# EAGLE design RPiPWM (EAGLE 9.0.1)
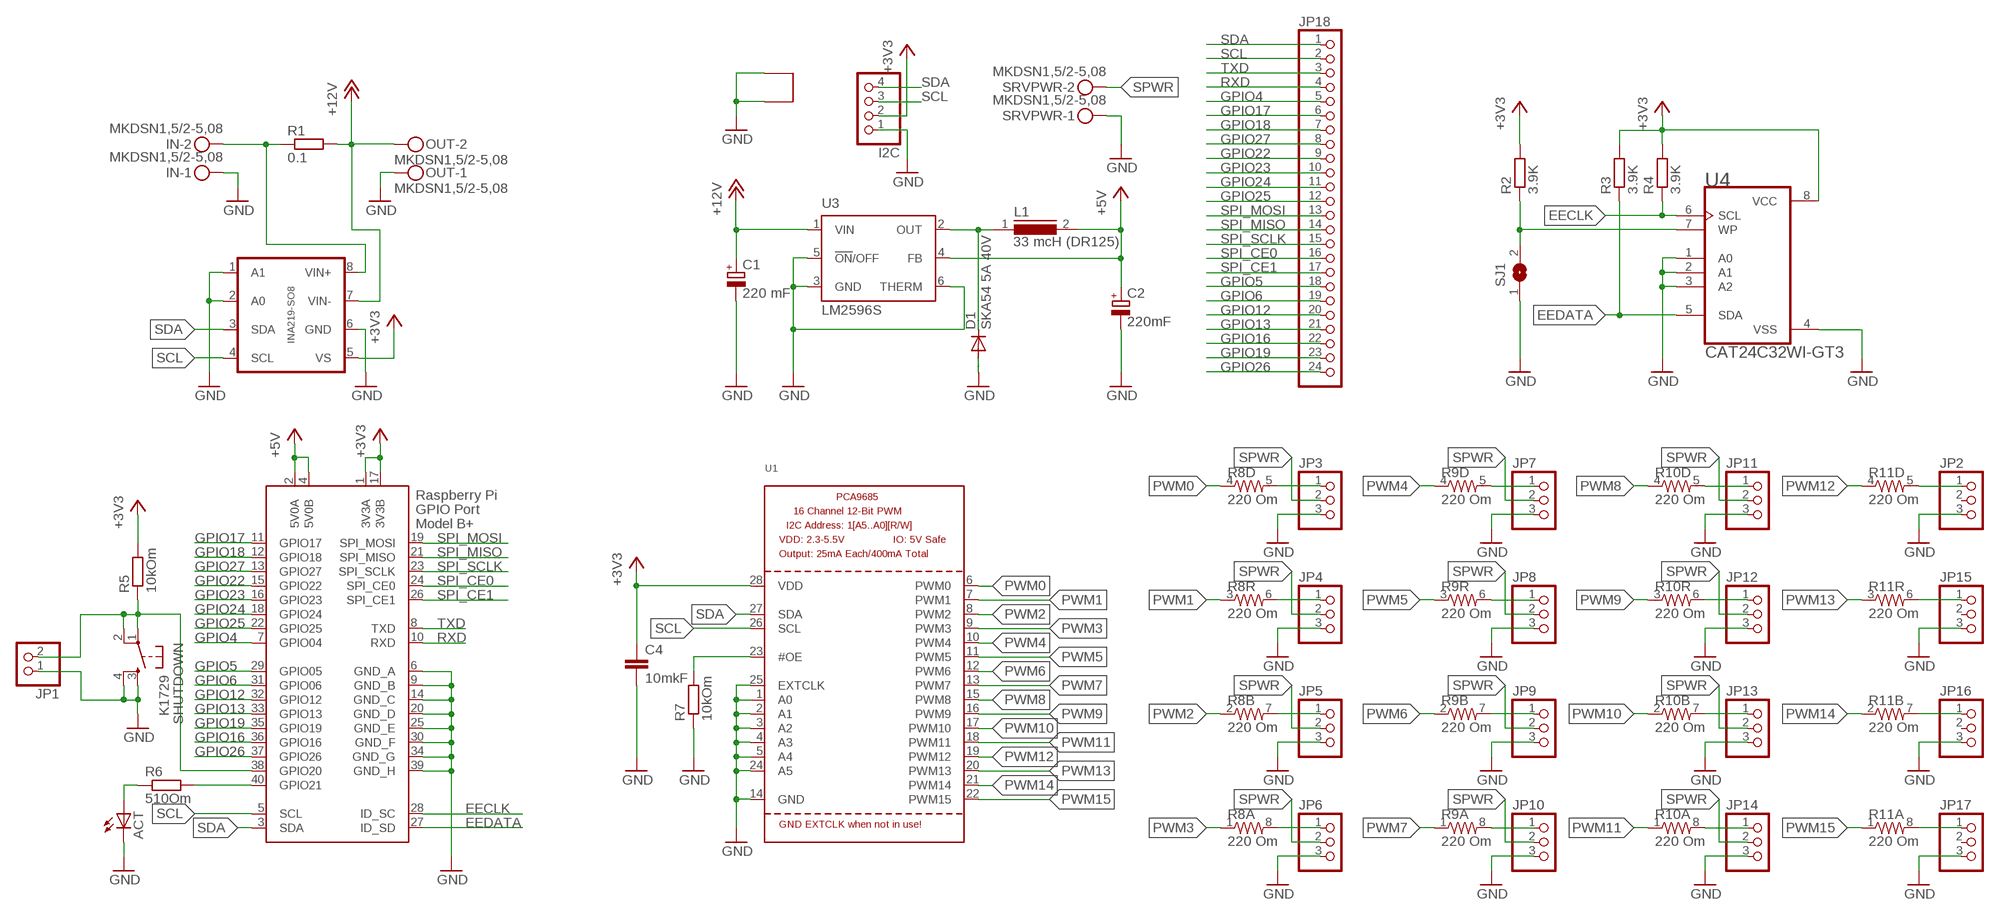
[diagram p0: schematic, sheet 1]

## Parts
ACT  LEDCHIPLED_1206  [CHIPLED_1206]
C1  220 mF  CPOL-EU140CLH-1014  [140CLH-1014]
C2  220mF  CPOL-EU140CLH-1014  [140CLH-1014]
C4  10mkF  C-EUC0805K  [C0805K]
D1  SKA54 5A 40V  DIODE-SMB  [SMB]
GNDLOOP  LOOP  [LOOP]
I2C  PINHD-1X04_2.54-S  [1X04-S]
IN  MKDSN1,5/2-5,08  [MKDSN1,5/2-5,08]
JP1  PINHD-1X02_2.54-S  [1X02-S]
JP2  PINHD-1X03_2.54-S  [1X03-S]
JP3  PINHD-1X03_2.54-S  [1X03-S]
JP4  PINHD-1X03_2.54-S  [1X03-S]
JP5  PINHD-1X03_2.54-S  [1X03-S]
JP6  PINHD-1X03_2.54-S  [1X03-S]
JP7  PINHD-1X03_2.54-S  [1X03-S]
JP8  PINHD-1X03_2.54-S  [1X03-S]
JP9  PINHD-1X03_2.54-S  [1X03-S]
JP10  PINHD-1X03_2.54-S  [1X03-S]
JP11  PINHD-1X03_2.54-S  [1X03-S]
JP12  PINHD-1X03_2.54-S  [1X03-S]
JP13  PINHD-1X03_2.54-S  [1X03-S]
JP14  PINHD-1X03_2.54-S  [1X03-S]
JP15  PINHD-1X03_2.54-S  [1X03-S]
JP16  PINHD-1X03_2.54-S  [1X03-S]
JP17  PINHD-1X03_2.54-S  [1X03-S]
JP18  PINHD-1X24_2.54-S  [1X24-S]
L1  33 mcH (DR125)  DR125  [DR125]
OUT  MKDSN1,5/2-5,08  [MKDSN1,5/2-5,08]
R1  0.1  R-EU_R2512  [R2512]
R2  3.9K  R-EU_R0805  [R0805]
R3  3.9K  R-EU_R0805  [R0805]
R4  3.9K  R-EU_R0805  [R0805]
R5  10kOm  R-EU_R0805  [R0805]
R6  510Om  R-EU_R0805  [R0805]
R7  10kOm  R-EU_R0805  [R0805]
R8  220 Om  RESISTOR-ARRAY0603-ARV  [0603-ARV]
R9  220 Om  RESISTOR-ARRAY0603-ARV  [0603-ARV]
R10  220 Om  RESISTOR-ARRAY0603-ARV  [0603-ARV]
R11  220 Om  RESISTOR-ARRAY0603-ARV  [0603-ARV]
SHUTDOWN  K1729  [DTSM-6]
SJ1  SJ  [SJ]
SRVPWR  MKDSN1,5/2-5,08  [MKDSN1,5/2-5,08]
U1  PCA9685  [TSSOP28]
U2  INA219-SO8D  [SO08]
U3  LM2596S  [TO263-5]
U4  CAT24C32WI-GT3  [SOIC127P600X175-8N]
X1  RASPI_BOARD_B+#_HDC  [RASPI_BOARD_B+HAT_DF_CF]

## Nets
+3V3: C4.1 I2C.2 R2.2 R3.2 R4.2 R5.2 U1.28(VDD) U2.5(VS) U4.8(VCC) X1.1(3V3A) X1.17(3V3B)
+5V: C2.+ L1.2 U3.4(FB) X1.2(5V0A) X1.4(5V0B)
+12V: C1.+ OUT.2 R1.2 U2.7(VIN-) U3.1(VIN)
EECLK: R4.1 U4.6(SCL) X1.28(ID_SC)
EEDATA: R3.1 U4.5(SDA) X1.27(ID_SD)
GND: ACT.C C1.- C2.- C4.2 D1.A GNDLOOP.P$1 GNDLOOP.P$2 I2C.1 IN.1 JP1.1 JP2.3 JP3.3 JP4.3 JP5.3 JP6.3 JP7.3 JP8.3 JP9.3 JP10.3 JP11.3 JP12.3 JP13.3 JP14.3 JP15.3 JP16.3 JP17.3 OUT.1 R7.1 SHUTDOWN.3 SHUTDOWN.4 SJ1.1 SRVPWR.1 U1.1(A0) U1.2(A1) U1.3(A2) U1.4(A3) U1.5(A4) U1.14(GND) U1.24(A5) U1.25(EXTCLK) U2.1(A1) U2.2(A0) U2.6(GND) U3.3(GND) U3.5(!ON!/OFF) U3.6(THERM) U4.1(A0) U4.2(A1) U4.3(A2) U4.4(VSS) X1.6(GND_A) X1.9(GND_B) X1.14(GND_C) X1.20(GND_D) X1.25(GND_E) X1.30(GND_F) X1.34(GND_G) X1.39(GND_H)
GPIO4: JP18.5 X1.7(GPIO04)
GPIO5: JP18.18 X1.29(GPIO05)
GPIO6: JP18.19 X1.31(GPIO06)
GPIO12: JP18.20 X1.32(GPIO12)
GPIO13: JP18.21 X1.33(GPIO13)
GPIO16: JP18.22 X1.36(GPIO16)
GPIO17: JP18.6 X1.11(GPIO17)
GPIO18: JP18.7 X1.12(GPIO18)
GPIO19: JP18.23 X1.35(GPIO19)
GPIO22: JP18.9 X1.15(GPIO22)
GPIO23: JP18.10 X1.16(GPIO23)
GPIO24: JP18.11 X1.18(GPIO24)
GPIO25: JP18.12 X1.22(GPIO25)
GPIO26: JP18.24 X1.37(GPIO26)
GPIO27: JP18.8 X1.13(GPIO27)
N$1: R6.2 X1.40(GPIO21)
N$2: ACT.A R6.1
N$3: D1.C L1.1 U3.2(OUT)
N$4: JP1.2 R5.1 SHUTDOWN.1 SHUTDOWN.2 X1.38(GPIO20)
N$5: JP3.1 R8.5
N$6: JP4.1 R8.6
N$7: JP7.1 R9.5
N$8: JP5.1 R8.7
N$9: R2.1 SJ1.2 U4.7(WP)
N$10: JP6.1 R8.8
N$11: JP11.1 R10.5
N$12: JP2.1 R11.5
N$13: JP15.1 R11.6
N$14: JP16.1 R11.7
N$15: JP17.1 R11.8
N$16: JP14.1 R10.8
N$17: JP13.1 R10.7
N$18: JP12.1 R10.6
N$19: JP8.1 R9.6
N$20: JP9.1 R9.7
N$21: JP10.1 R9.8
N$22: IN.2 R1.1 U2.8(VIN+)
N$23: R7.2 U1.23(#OE)
PWM0: R8.4 U1.6(PWM0)
PWM1: R8.3 U1.7(PWM1)
PWM2: R8.2 U1.8(PWM2)
PWM3: R8.1 U1.9(PWM3)
PWM4: R9.4 U1.10(PWM4)
PWM5: R9.3 U1.11(PWM5)
PWM6: R9.2 U1.12(PWM6)
PWM7: R9.1 U1.13(PWM7)
PWM8: R10.4 U1.15(PWM8)
PWM9: R10.3 U1.16(PWM9)
PWM10: R10.2 U1.17(PWM10)
PWM11: R10.1 U1.18(PWM11)
PWM12: R11.4 U1.19(PWM12)
PWM13: R11.3 U1.20(PWM13)
PWM14: R11.2 U1.21(PWM14)
PWM15: R11.1 U1.22(PWM15)
RXD: JP18.4 X1.10(RXD)
SCL: I2C.3 JP18.2 U1.26(SCL) U2.4(SCL) X1.5(SCL)
SDA: I2C.4 JP18.1 U1.27(SDA) U2.3(SDA) X1.3(SDA)
SPI_CE0: JP18.16 X1.24(SPI_CE0)
SPI_CE1: JP18.17 X1.26(SPI_CE1)
SPI_MISO: JP18.14 X1.21(SPI_MISO)
SPI_MOSI: JP18.13 X1.19(SPI_MOSI)
SPI_SCLK: JP18.15 X1.23(SPI_SCLK)
SPWR: JP3.2 JP4.2 JP5.2 JP6.2 JP7.2 JP8.2 JP9.2 JP10.2 JP11.2 JP12.2 JP13.2 JP14.2 SRVPWR.2
TXD: JP18.3 X1.8(TXD)
Unconnected: JP2.2 JP15.2 JP16.2 JP17.2

## Library data of the parts
ACT = led:LED: LED OSRAM: - CHIPLED LG R971, LG N971, LY N971, LG Q971, LY Q971, LO R971, LY R971 LH N974, LH R974 LS Q976, LO Q976, LY Q976 LO Q996 - Hyper CHIPLED LW Q18S LB Q993, LB Q99A, LB R99A - SideLED LS A670, LO A670, LY A670, LG A670, LP A670 LB A673, LV A673, LT A673, LW A673 LH A674 LY A675 LS A676, LA A676, LO A676, LY A676, LW A676 LS A679, LY A679, LG A679 - Hyper Micro SIDELED® LS Y876, LA Y876, LO Y876, LY Y876 LT Y87S - SmartLED LW L88C, LW L88S LB L89C, LB L89S, LG L890 LS L89K, LO L89K, LY L89K LS L896, LA L896, LO L896, LY L896 - TOPLED LS T670, LO T670, LY T670, LG T670, LP T670 LSG T670, LSP T670, LSY T670, LOP T670, LYG T670 LG T671, LOG T671, LSG T671 LB T673, LV T673, LT T673, LW T673 LH T674 LS T676, LA T676, LO T676, LY T676, LB T676, LH T676, LSB T676, LW T676 LB T67C, LV T67C, LT T67C, LS T67K, LO T67K, LY T67K, LW E67C LS E67B, LA E67B, LO E67B, LY E67B, LB E67C, LV E67C, LT E67C LW T67C LS T679, LY T679, LG T679 LS T770, LO T770, LY T770, LG T770, LP T770 LB T773, LV T773, LT T773, LW T773 LH T774 LS E675, LA E675, LY E675, LS T675 LS T776, LA T776, LO T776, LY T776, LB T776 LHGB T686 LT T68C, LB T68C - Hyper Mini TOPLED® LB M676 - Mini TOPLED Santana® LG M470 LS M47K, LO M47K, LY M47K Source: http://www.osram.convergy.de LUXEON: - LUMILED® LXK2-PW12-R00, LXK2-PW12-S00, LXK2-PW14-U00, LXK2-PW14-V00 LXK2-PM12-R00, LXK2-PM12-S00, LXK2-PM14-U00 LXK2-PE12-Q00, LXK2-PE12-R00, LXK2-PE12-S00, LXK2-PE14-T00, LXK2-PE14-U00 LXK2-PB12-K00, LXK2-PB12-L00, LXK2-PB12-M00, LXK2-PB14-N00, LXK2-PB14-P00, LXK2-PB14-Q00 LXK2-PR12-L00, LXK2-PR12-M00, LXK2-PR14-Q00, LXK2-PR14-R00 LXK2-PD12-Q00, LXK2-PD12-R00, LXK2-PD12-S00 LXK2-PH12-R00, LXK2-PH12-S00 LXK2-PL12-P00, LXK2-PL12-Q00, LXK2-PL12-R00 Source: www.luxeon.com KINGBRIGHT: KA-3528ASYC Source: www.kingbright.com
C1 C2 = rcl:CPOL-EU: POLARIZED CAPACITOR, European symbol; SPICEPREFIX: C
C4 = rcl:C-EU: CAPACITOR, European symbol; SPICEPREFIX: C
D1 = diode:DIODE-: DIODE
GNDLOOP = newlib:LOOP
I2C = pinhead-2:PINHD-1X04: PIN HEADER
IN OUT SRVPWR = con-phoenix-508:MKDSN1,5/2-5,08: MKDSN 1,5/ 2-5,08 Printklemme Nennstrom: 13,5 A Nennspannung: 250 V Rastermaß: 5,08 mm Polzahl: 2 Anschlussart: Schraubanschluss Montage: Löten Anschlussrichtung Leiter/Platine: 0 ° Artikelnummer: 1729128 Source: http://eshop.phoenixcontact.com .. 1729128.pdf
JP1 = pinhead-2:PINHD-1X02: PIN HEADER
JP2-JP17 = pinhead-2:PINHD-1X03: PIN HEADER
JP18 = pinhead-2:PINHD-1X24: PIN HEADER
L1 = inductors:DR125: High Power Density, High Efficiency, Shielded Inductors Source: coiltronics_dr_series.pdf; SPICEPREFIX: L
R1-R7 = rcl:R-EU_: RESISTOR, European symbol; SPICEPREFIX: R
R8-R11 = SparkFun-Resistors:RESISTOR-ARRAY: Array Chip Resistor Source: RS Component / Phycomp
SHUTDOWN = switch-tact:K1729
SJ1 = jumper:SJ: SMD solder JUMPER
U1 = adafruit:PCA9685: PCA9685 - 16 Channel 12-Bit I2C PWM Controller 5.0V tolerant 16 channel, 12-bit I2C PWM controller with 25mA per output (max. 400mA total) Digikey: 568-5931-1-ND
U2 = INA219 :INA219-SO8: INA219 Bi-Directional CURRENT/POWER MONITOR with I2C™ Interface http://www.ti.com/lit/ds/symlink/ina219.pdf
U3 = newlib:LM2596S
U4 = CAT24C32WI-GT3:CAT24C32WI-GT3: CAT24C32 Series 32 Kb (4K X 8) 1.8 V - 5.5 V I2C CMOS Serial EEPROM - SOIC-8; AVAILABILITY: Unavailable; DESCRIPTION: IC EEPROM 32KBIT 400KHZ 8SOIC; MF: ON; MP: CAT24C32WI-GT3; PACKAGE: SOIC-8 ON; PRICE: None
X1 = raspberrypi_bastelstube_v13:RASPI_BOARD_B+#: Raspberry Pi GPIO connector with markings for the outer dimensions of the Raspberry Pi board model B+ with different sets of drill holes or mounting pads All pins connected

## Board
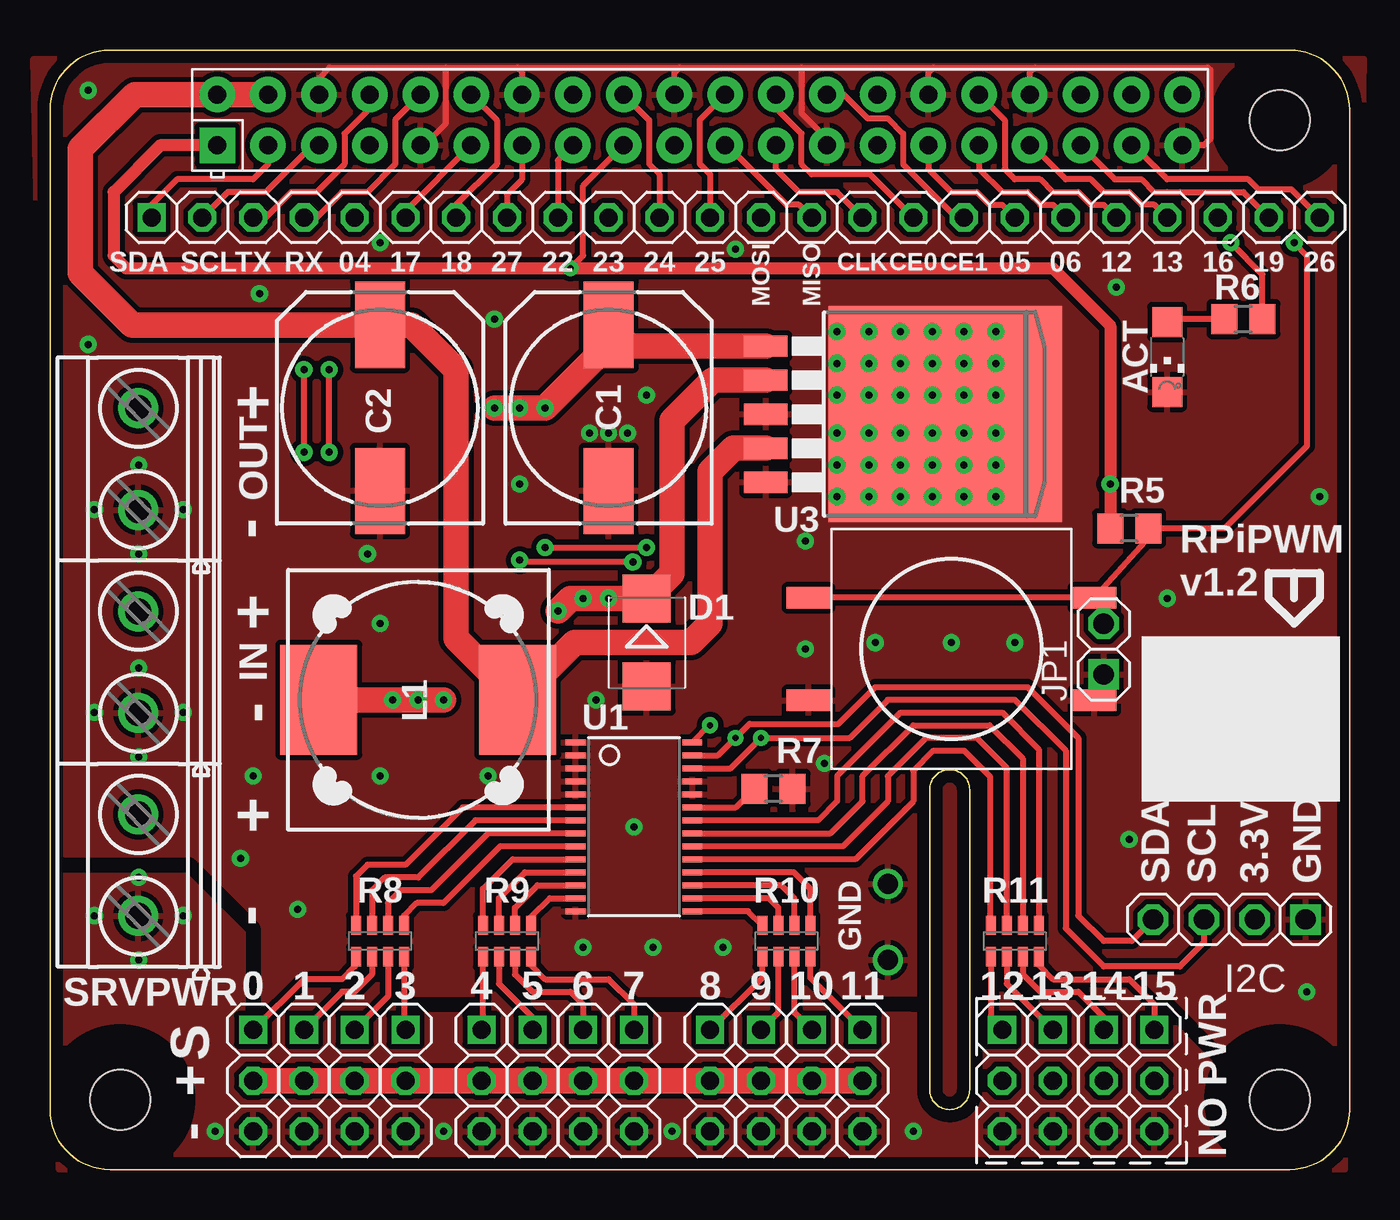
[diagram p1: board, top side]
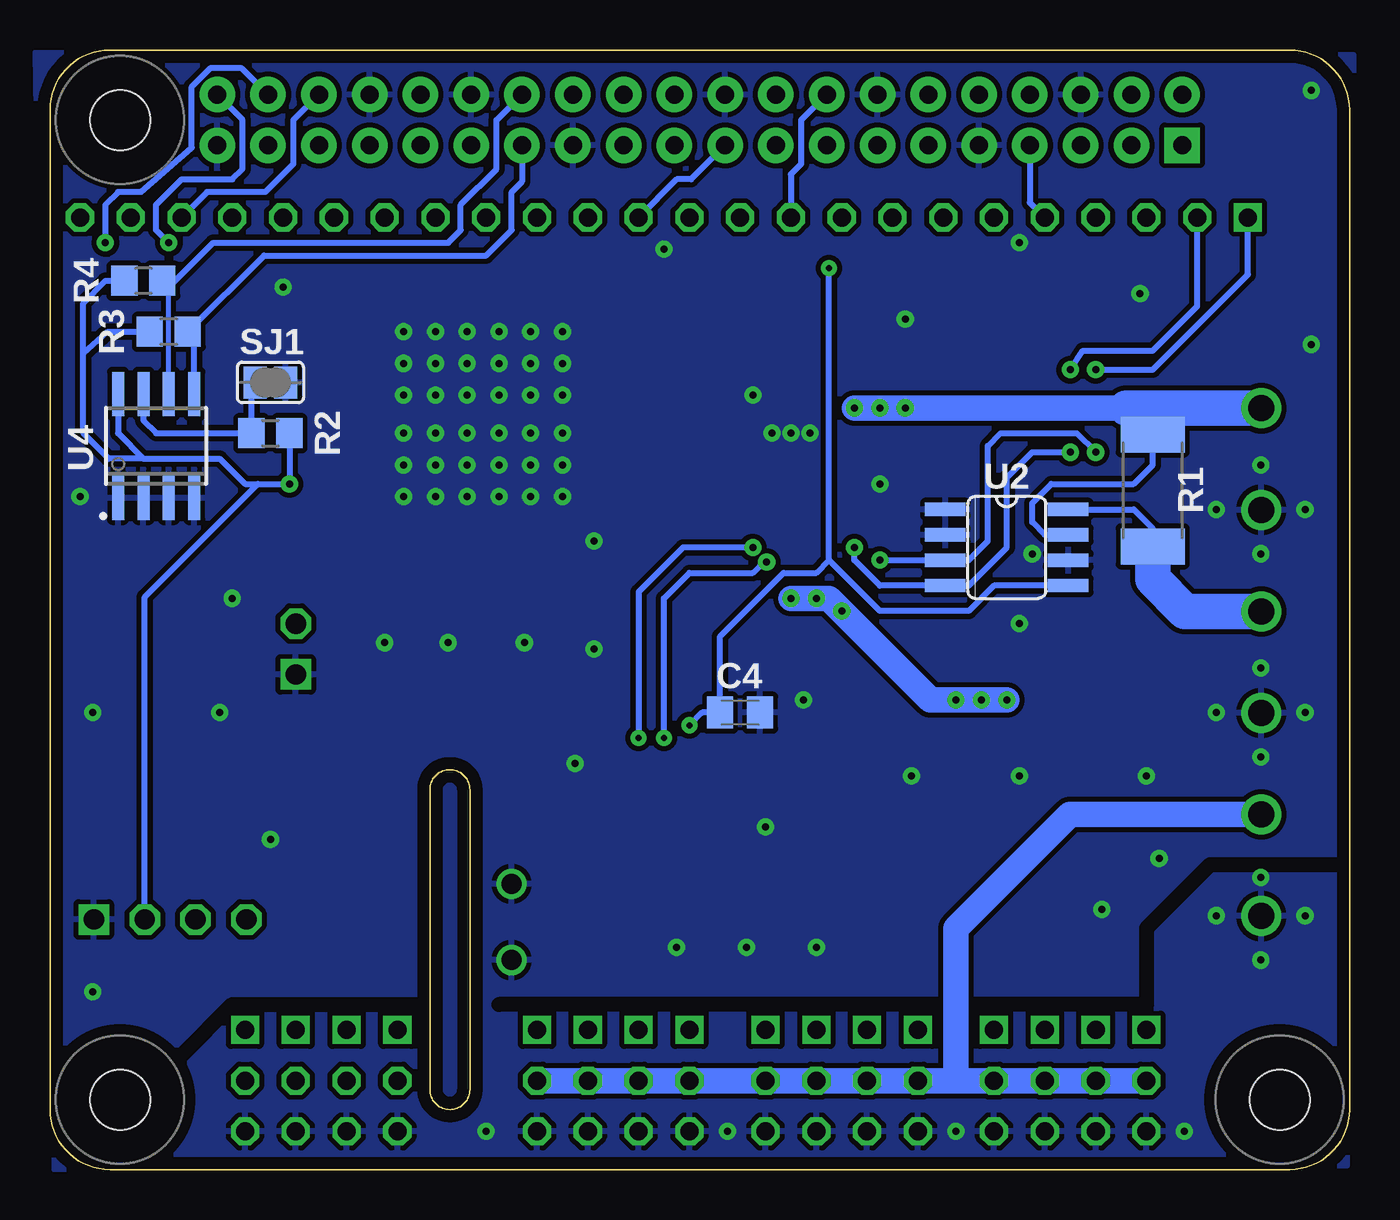
[diagram p2: board, bottom side, seen from below]

Size 65 x 56 mm. Coordinates in mm from the lower left corner, seen from the top.
Copper layers (1*16): Top 0.035mm / dielectric 1.5mm / Bottom 0.035mm
Design rules "default *": minimum track width 0.15mm, minimum drill 0.3mm, track to track 0.15mm, track to pad 0.15mm, pad to pad 0.15mm, via to via 0.15mm, smd to smd 0.15mm, copper to edge 0.6mm, drill to drill 0.3mm, minimum pad ring 10mil, minimum via ring 10mil, stop-mask expansion 2mil, vias tented up to drill 0.4mm, thermal gap 10mil
tRestrict: 7 lines
bRestrict: 7 lines

### Footprints (pad centres in the part's own frame; a part is rotated, then mirrored left to right if it is on the bottom)
CHIPLED_1206 = smd 1.5 x 1.5: A 0,-1.75; C 0,1.75
140CLH-1014 = smd 4.3 x 2.5: + 4.15,0; - -4.15,0
C0805K = smd 1.3 x 1.6: 1 -1,0; 2 1,0
SMB = smd 2.4 x 2.4: A 2.2,0; C -2.2,0
LOOP = drill 1: P$1 -1.905,0; P$2 1.905,0
1X04-S = drill 1.016 square: 1 -3.81,0 | drill 1.016 octagon: 2 -1.27,0; 3 1.27,0; 4 3.81,0
MKDSN1,5/2-5,08 = drill 1.3 pad 2: 1 -2.561,0.025; 2 2.519,0.025
1X02-S = drill 1.016 square: 1 -1.27,0 | drill 1.016 octagon: 2 1.27,0
1X03-S = drill 0.9 square: 1 -2.54,0 | drill 0.9 octagon: 2 0,0; 3 2.54,0
1X24-S = drill 0.9 square: 1 -29.21,0 | drill 0.9 octagon: 2 -26.67,0; 3 -24.13,0; 4 -21.59,0; 5 -19.05,0; 6 -16.51,0; 7 -13.97,0; 8 -11.43,0; 9 -8.89,0; 10 -6.35,0; 11 -3.81,0; 12 -1.27,0; 13 1.27,0; 14 3.81,0; 15 6.35,0; 16 8.89,0; 17 11.43,0; 18 13.97,0; 19 16.51,0; 20 19.05,0; 21 21.59,0; 22 24.13,0; 23 26.67,0; 24 29.21,0
DR125 = smd 3.85 x 5.5: 1 -4.975,0; 2 4.975,0
R2512 = smd 1.8 x 3.2: 1 -2.8,0; 2 2.8,0
R0805 = smd 1.3 x 1.5: 1 -0.95,0; 2 0.95,0
0603-ARV = smd 0.5 x 0.968: 1 -1.2,-0.784; 2 -0.4,-0.784; 3 0.4,-0.784; 4 1.2,-0.784; 5 1.2,0.784; 6 0.4,0.784; 7 -0.4,0.784; 8 -1.2,0.784
DTSM-6 = smd 2.184 x 1.067: 1 -7.15,2.567; 2 7.15,2.567; 3 -7.15,-2.567; 4 7.15,-2.567
SJ = smd 1.168 x 1.6: 1 -0.762,0; 2 0.762,0
TSSOP28 = smd 0.305 x 0.991: 1 -4.225,-2.918; 2 -3.575,-2.918; 3 -2.925,-2.918; 4 -2.275,-2.918; 5 -1.625,-2.918; 6 -0.975,-2.918; 7 -0.325,-2.918; 8 0.325,-2.918; 9 0.975,-2.918; 10 1.625,-2.918; 11 2.275,-2.918; 12 2.925,-2.918; 13 3.575,-2.918; 14 4.225,-2.918; 15 4.225,2.918; 16 3.575,2.918; 17 2.925,2.918; 18 2.275,2.918; 19 1.625,2.918; 20 0.975,2.918; 21 0.325,2.918; 22 -0.325,2.918; 23 -0.975,2.918; 24 -1.625,2.918; 25 -2.275,2.918; 26 -2.925,2.918; 27 -3.575,2.918; 28 -4.225,2.918
SO08 = smd 2.032 x 0.66: 1 -3.073,1.905; 2 -3.073,0.635; 3 -3.073,-0.635; 4 -3.073,-1.905; 5 3.073,-1.905; 6 3.073,-0.635; 7 3.073,0.635; 8 3.073,1.905
TO263-5 = smd 1.067 x 2.159: 1 -3.404,-5.791; 2 -1.702,-5.791; 3 0,-5.791; 4 1.702,-5.791; 5 3.404,-5.791 | smd 10.8 x 11.68: 6 0,3.175
SOIC127P600X175-8N = smd 2.2 x 0.6: 1 -2.6,1.905; 2 -2.6,0.635; 3 -2.6,-0.635; 4 -2.6,-1.905; 5 2.6,-1.905; 6 2.6,-0.635; 7 2.6,0.635; 8 2.6,1.905
RASPI_BOARD_B+HAT_DF_CF = drill 0.9 pad 1.778 square: 1 8.37,51.23 | drill 0.9 pad 1.778: 2 8.37,53.77; 3 10.91,51.23; 4 10.91,53.77; 5 13.45,51.23; 6 13.45,53.77; 7 15.99,51.23; 8 15.99,53.77; 9 18.53,51.23; 10 18.53,53.77; 11 21.07,51.23; 12 21.07,53.77; 13 23.61,51.23; 14 23.61,53.77; 15 26.15,51.23; 16 26.15,53.77; 17 28.69,51.23; 18 28.69,53.77; 19 31.23,51.23; 20 31.23,53.77; 21 33.77,51.23; 22 33.77,53.77; 23 36.31,51.23; 24 36.31,53.77; 25 38.85,51.23; 26 38.85,53.77; 27 41.39,51.23; 28 41.39,53.77; 29 43.93,51.23; 30 43.93,53.77; 31 46.47,51.23; 32 46.47,53.77; 33 49.01,51.23; 34 49.01,53.77; 35 51.55,51.23; 36 51.55,53.77; 37 54.09,51.23; 38 54.09,53.77; 39 56.63,51.23; 40 56.63,53.77 | hole 3: 3.5,3.5; 61.5,3.5; 61.5,52.5

### Placement (x,y rotation side)
ACT  55.88,40.64 180 top
C1  27.94,38.1 90 top
C2  16.51,38.1 90 top
C4  30.48,22.86 0 bottom
D1  29.84,26.35 270 top
GNDLOOP  41.91,12.38 90 top
I2C  58.99,12.51 180 top
IN  4.45,25.4 90 top
JP1  52.7,26.04 90 top
JP2  47.62,4.45 270 top
JP3  10.16,4.45 270 top
JP4  12.7,4.45 270 top
JP5  15.24,4.45 270 top
JP6  17.78,4.45 270 top
JP7  21.59,4.45 270 top
JP8  24.13,4.45 270 top
JP9  26.67,4.45 270 top
JP10  29.21,4.45 270 top
JP11  33.02,4.45 270 top
JP12  35.56,4.45 270 top
JP13  38.1,4.45 270 top
JP14  40.64,4.45 270 top
JP15  50.16,4.45 270 top
JP16  52.7,4.45 270 top
JP17  55.24,4.45 270 top
JP18  34.29,47.62 0 top
L1  18.41,23.5 0 top
OUT  4.45,35.56 90 top
R1  9.84,33.97 90 bottom
R2  53.98,36.83 0 bottom
R3  59.05,41.91 180 bottom
R4  60.33,44.45 180 bottom
R5  53.98,32.07 180 top
R6  59.69,42.55 0 top
R7  36.2,19.05 180 top
R8  16.51,11.43 180 top
R9  22.86,11.43 180 top
R10  36.83,11.43 180 top
R11  48.26,11.43 180 top
SHUTDOWN  45.09,26.04 0 top
SJ1  53.98,39.37 180 bottom
SRVPWR  4.45,15.24 90 top
U1  29.21,17.14 270 top
U2  17.14,31.11 0 bottom
U3  41.59,37.78 270 top
U4  59.69,36.2 90 bottom
U$1  [MASKLABEL]  62.23,28.57 0 top
X1  0,0 0 top

### Tracks (layer width: path | path; a pad name or v marks a point on that pad's centre or on a via)
+3V3  (via drill 0.3, 0.35)
  Top 0.305: v26.04,45.09 26.67,45.72 26.67,49.21 X1.17 | v33.02,22.23 33.02,22.26 U1.28
  Top 0.61: X1.1 5.51,51.23 3.17,48.9 3.17,45.72 3.81,45.09 v26.04,45.09 50.16,45.09 53.02,42.23 v53.02,34.29 R5.2
  Bottom 0.305: U4.8 61.59,36.83 60.33,35.56 | 60.33,35.56 56.52,35.56 55.24,34.29 54.61,34.29 | 60.33,35.56 62.06,35.56 63.33,36.83 63.33,40.81 | 63.33,40.81 62.1,41.91 R3.2 | 63.33,40.81 63.33,43.35 62.23,44.45 R4.2 | U2.5 17.78,29.21 19.05,27.94 23.5,27.94 26.04,30.48 | 26.04,30.48 v26.04,45.09 | v33.02,22.23 32.38,22.86 C4.1 31.48,26.67 28.3,29.84 26.67,29.84 26.04,30.48 | 54.61,34.29 v53.02,34.29 R2.2 | 54.61,34.29 60.26,28.64 I2C.2
  Bottom 0.61: 31.75,23.13 C4.1
+5V
  Top 1.27: X1.4 X1.2 4.24,53.77 1.52,51.05 1.52,44.83 4.11,42.25 C2.+ 18.07,42.25 20.32,40.01 20.32,26.57 L1.2 26.25,26.35 32.07,26.35 33.02,27.3 33.02,34.92 34.18,36.08 U3.4
+12V  (via drill 0.35)
  Top 1.27: U3.1 29,41.19 C1.+ 27.94,41.27 v24.77,38.1 v23.5,38.1 v22.23,38.1
  Bottom 0.305: U2.7 15.24,31.75 15.88,32.38 15.88,33.34 14.92,34.29 10.79,34.29 9.84,35.24 R1.2 9.84,36.51 9.53,36.2
  Bottom 1.27: R1.2 11.17,38.1 v24.77,38.1 | 4.44,38.1 OUT.2
  Bottom 1.778: 11.17,38.1 4.44,38.1
EECLK
  Bottom 0.254: R4.1 59.05,44.13 U4.6
  Bottom 0.305: X1.28 42.67,52.49 42.67,50.04 44.45,48.26 44.45,46.99 45.09,46.35 56.83,46.35 59.05,44.13
EEDATA
  Bottom 0.305: X1.27 41.39,49.41 41.91,48.9 41.91,46.99 43.18,45.72 54.3,45.72 R3.1 57.78,41.59 U4.5
GND  (via drill 0.35)
  Top 0.305: X1.6 13.45,54.6 13.97,55.12 19.81,55.12 | X1.39 57.71,51.23 58.04,51.56 58.04,54.99 57.91,55.12 49.28,55.12 | 19.81,55.12 23.37,55.12 | 23.37,55.12 31.5,55.12 | 31.5,55.12 37.59,55.12 | 37.59,55.12 44.2,55.12 | 44.2,55.12 49.28,55.12 | 49.01,53.96 X1.34 49.01,54.85 49.28,55.12 | 43.93,54.6 X1.30 43.93,54.85 44.2,55.12 | 31.23,54.6 X1.20 31.23,54.85 31.5,55.12 | X1.9 18.72,51.23 19.81,52.32 19.81,55.12 | 37.59,55.12 37.59,52.83 38.85,51.57 X1.25 | 23.37,55.12 23.61,54.88 X1.14
  other vias: 1.91,53.98 26.67,11.11 43.18,1.91 12.38,13.02 29.21,17.14 31.11,1.91 19.68,1.91 8.26,1.91 23.5,34.29 16.51,27.3 29.84,38.73 38.73,20.32 53.34,44.13 39.37,41.91 39.37,40.32 39.37,38.73 39.37,36.83 39.37,35.24 39.37,33.66 41.27,26.35 48.26,26.35 22.23,42.55 27.3,23.5 10.16,19.68 62.87,8.89 53.98,16.51 56.52,22.86 62.87,22.86 55.88,28.57 40.96,41.91 40.96,40.32 40.96,38.73 40.96,36.83 40.96,35.24 40.96,33.66 42.55,41.91 42.55,40.32 42.55,38.73 42.55,36.83 42.55,35.24 42.55,33.66 44.13,41.91 44.13,40.32 44.13,38.73 44.13,36.83 44.13,35.24 44.13,33.66 45.72,41.91 45.72,40.32 45.72,38.73 45.72,36.83 45.72,35.24 45.72,33.66 47.31,41.91 47.31,40.32 47.31,38.73 47.31,36.83 47.31,35.24 47.31,33.66 26.99,36.83 27.94,36.83 28.89,36.83 15.88,30.8 45.09,26.35 4.45,25.08 2.22,22.86 6.67,22.86 4.45,20.64 4.45,35.24 6.67,33.02 4.45,30.8 2.22,33.02 4.45,14.61 6.67,12.7 4.45,10.48 2.22,12.7 16.51,19.68 21.91,19.68 9.53,15.56 1.91,41.27 10.48,43.81 16.51,46.35 34.29,46.04 63.5,33.66 33.66,11.11 30.16,11.11 37.78,26.04 37.78,31.43
  pour Top (isolate 0.254): -0.83,55.56 65.72,55.56 64.77,0 0.44,0
  pour Bottom (isolate 0.254): -0.19,55.75 0.13,0.19 64.77,0 65.72,55.88
GPIO4
  Bottom 0.305: X1.7 15.99,48.38 JP18.5
GPIO5
  Top 0.305: X1.29 43.93,50.05 45.09,48.9 46.35,48.9 46.99,48.26 47.62,48.26 JP18.18
GPIO6
  Top 0.305: X1.31 46.47,50.05 47.62,48.9 48.9,48.9 49.53,48.26 50.16,48.26 JP18.19
GPIO12
  Top 0.305: X1.32 47.75,52.49 47.75,50.04 48.26,49.53 49.53,49.53 50.16,48.9 51.44,48.9 52.07,48.26 52.7,48.26 JP18.20
GPIO13
  Top 0.305: X1.33 49.1,51.23 50.8,49.53 52.07,49.53 52.7,48.9 53.98,48.9 54.61,48.26 55.24,48.26 JP18.21
GPIO16
  Bottom 0.305: X1.36 52.83,52.49 52.83,50.29 54.23,48.9 54.61,48.9 56.52,48.9 57.15,48.9 JP18.22
GPIO17
  Top 0.305: X1.11 17.78,47.94 JP18.6
GPIO18
  Top 0.305: X1.12 22.35,52.49 22.35,50.29 20.32,48.26 JP18.7
GPIO19
  Top 0.305: X1.35 53.25,49.53 54.61,49.53 55.24,48.9 55.88,48.9 56.52,48.9 59.69,48.9 JP18.23
GPIO22
  Top 0.305: X1.15 25.4,50.48 JP18.9
GPIO23
  Bottom 0.305: X1.16 27.43,52.49 27.43,50.29 27.94,49.78 JP18.10
GPIO24
  Top 0.305: X1.18 29.97,52.49 29.97,50.29 30.48,49.78 JP18.11
GPIO25
  Top 0.305: X1.22 32.51,52.51 32.51,50.29 33.02,49.78 JP18.12
GPIO26
  Top 0.305: X1.37 54.18,51.23 55.88,49.53 59.94,49.53 60.45,49.02 62.1,49.02 JP18.24
GPIO27
  Top 0.305: X1.13 23.61,49.52 22.86,48.77 JP18.8
N$1  (via drill 0.35)
  Top 0.305: R6.2 60.64,44.77 v59.05,46.35
  Bottom 0.305: v59.05,46.35 59.69,46.99 59.69,48.26 58.42,49.53 55.88,49.53 55.37,50.04 55.37,52.51 X1.40
N$2
  Top 0.305: R6.1 56.03,42.55 ACT.A
N$3  (via drill 0.35)
  Top 1.27: U3.2 33.13,39.48 31.11,37.47 31.11,29.82 D1.C 26.69,28.55 v26.67,28.57 26.04,28.57 v25.4,27.94 | L1.1 v18.41,23.5 v19.68,23.5
  Bottom 1.27: v17.14,23.5 v18.41,23.5 20.95,23.5 26.04,28.57 v26.67,28.57 27.3,28.57 v27.94,28.57
N$4  (via drill 0.35)
  Top 0.305: v62.23,46.35 62.87,45.72 62.87,36.2 58.74,32.07 55.24,32.07 | 55.24,32.07 R5.1 | SHUTDOWN.2 55.24,31.93 55.24,32.07 | SHUTDOWN.2 SHUTDOWN.1 | JP1.2 52.7,28.45 SHUTDOWN.2
  Bottom 0.305: X1.38 55.41,55.09 57,55.09 57.91,54.17 57.91,51.12 60.45,48.9 61.59,48.9 62.23,48.26 v62.23,46.35
N$5
  Top 0.305: R8.5 15.24,10.73 15.24,10.16 14.61,9.53 12.7,9.53 JP3.1
N$6
  Top 0.305: R8.6 16.11,9.76 15.24,8.89 14.61,8.89 JP4.1
N$7
  Top 0.305: JP7.1 21.66,7.05 R9.5
N$8
  Top 0.305: R8.7 16.91,8.65 JP5.1
N$9
  Bottom 0.305: U4.7 60.33,37.47 59.69,36.83 R2.1 54.92,39.18 SJ1.2
N$10
  Top 0.305: R8.8 17.71,7.05 JP6.1
N$11
  Top 0.305: R10.5 35.63,9.6 JP11.1
N$12
  Top 0.305: R11.5 47.06,7.55 JP2.1
N$13
  Top 0.305: R11.6 47.86,9.29 JP15.1
N$14
  Top 0.305: R11.7 48.66,9.76 49.53,8.89 51.44,8.89 52.7,7.62 JP16.1
N$15
  Top 0.305: R11.8 49.46,10.23 50.16,9.53 53.98,9.53 55.24,8.26 JP17.1
N$16
  Top 0.305: R10.8 38.03,9.6 JP14.1
N$17
  Top 0.305: JP13.1 37.23,7.86 R10.7
N$18
  Top 0.305: JP12.1 36.43,7.86 R10.6
N$19
  Top 0.305: R9.6 22.46,9.29 24.13,7.62 JP8.1
N$20
  Top 0.305: R9.7 23.26,9.76 24.13,8.89 26.04,8.89 26.67,8.26 JP9.1
N$21
  Top 0.305: R9.8 24.06,10.23 24.77,9.53 27.94,9.53 29.21,8.26 JP10.1
N$22
  Bottom 0.305: 9.84,31.43 R1.1 9.84,32.07 10.79,33.02 U2.8
  Bottom 0.406: 13.99,33.1 U2.8
  Bottom 1.778: IN.2 8.23,27.92 9.84,29.53 R1.1
N$23
  Top 0.305: U1.23 34.31,18.12 R7.2
PWM0
  Top 0.305: U1.6 20.66,18.12 17.78,15.24 15.88,15.24 15.31,14.68 R8.4
PWM1
  Top 0.305: U1.7 21.28,17.47 18.41,14.61 16.75,14.61 16.11,13.97 R8.3
PWM2
  Top 0.305: U1.8 21.9,16.82 19.05,13.97 17.55,13.97 16.91,13.34 R8.2
PWM3
  Top 0.305: U1.9 22.52,16.17 19.68,13.34 18.34,13.34 17.71,12.7 R8.1
PWM4
  Top 0.305: R9.4 21.66,14.04 23.14,15.52 U1.10
PWM5
  Top 0.305: R9.3 22.46,13.57 23.76,14.87 U1.11
PWM6
  Top 0.305: 23.26,12.46 R9.2 23.26,13.1 24.38,14.22 U1.12
PWM7
  Top 0.305: R9.1 24.06,12.63 25,13.57 U1.13
PWM8
  Top 0.305: R10.4 34.92,12.92 U1.15
PWM9
  Top 0.305: R10.3 36.43,13.1 35.96,13.57 U1.16
PWM10
  Top 0.305: R10.2 37.23,13.57 36.58,14.22 U1.17
PWM11
  Top 0.305: R10.1 38.03,14.04 37.2,14.87 U1.18
PWM12
  Top 0.305: U1.19 40.28,15.52 43.18,18.41 43.18,19.94 44.2,20.95 45.72,20.95 47.02,19.66 47.02,12.1 R11.4
PWM13
  Top 0.305: U1.20 39.66,16.17 41.91,18.41 41.91,19.68 43.81,21.59 46.35,21.59 47.86,20.09 R11.3
PWM14
  Top 0.305: U1.21 39.05,16.82 40.64,18.41 40.64,19.68 43.18,22.23 46.99,22.23 48.66,20.55 R11.2
PWM15
  Top 0.305: U1.22 38.42,17.47 39.37,18.41 39.37,19.68 42.55,22.86 47.62,22.86 49.46,21.02 R11.1
RXD
  Top 0.305: X1.10 17.27,52.51 17.27,50.29 15.88,48.9 14.61,48.9 13.34,47.62 JP18.4
SCL  (via drill 0.3, 0.35)
  Top 0.305: U1.26 34.04,20.07 v35.56,21.59 40.01,21.59 41.91,23.5 48.26,23.5 50.8,20.95 50.8,12.06 52.7,10.16 56.52,10.16 57.72,11.37 I2C.3 | X1.5 13.13,51.23 10.79,48.9 8.89,48.9 JP18.2 | v13.97,35.88 v13.97,40.01 | v24.77,31.11 v29.84,31.11
  Bottom 0.305: v35.56,21.59 35.56,28.89 33.34,31.11 v29.84,31.11 | v13.97,35.88 15.88,35.88 17.14,34.61 17.14,31.11 19.05,29.21 U2.4 23.5,29.21 24.77,30.48 v24.77,31.11 | v13.97,40.01 13.34,40.96 9.84,40.96 7.62,43.18 JP18.2
SDA  (via drill 0.3, 0.35)
  Top 0.305: X1.3 10.91,50.28 10.16,49.53 6.35,49.53 5.08,48.26 JP18.1 | U1.27 33.42,20.72 v34.29,21.59 35,22.3 39.44,22.3 41.27,24.13 48.9,24.13 51.44,21.59 51.44,12.7 52.7,11.43 54.1,11.43 I2C.4 | v12.7,35.88 v12.7,40.01 | v29.15,30.38 23.59,30.38 v23.5,30.48
  Bottom 0.305: v34.29,21.59 34.29,28.57 33.02,29.84 29.84,29.84 29.21,30.48 29.15,30.42 v29.15,30.38 | v12.7,40.01 9.84,40.01 5.08,44.77 JP18.1 | v12.7,35.88 13.65,36.83 17.46,36.83 18.1,36.2 18.1,31.43 19.05,30.48 U2.3 v23.5,30.48
SPI_CE0
  Top 0.305: X1.24 36.31,53.1 37.59,51.82 37.59,50.29 38.1,49.78 41.02,49.78 JP18.16
SPI_CE1
  Top 0.305: X1.26 39.7,53.77 40.9,52.58 41.91,52.58 42.67,51.82 42.67,50.29 45.34,47.62 JP18.17
SPI_MISO
  Top 0.305: JP18.14 37.47,48.26 36.83,48.26 33.86,51.23 X1.21
SPI_MOSI
  Bottom 0.305: X1.19 32.93,49.53 33.66,49.53 JP18.13
SPI_SCLK
  Top 0.305: X1.23 36.31,50.05 37.47,48.9 39.37,48.9 JP18.15
SPWR
  Top 1.27: JP3.2 JP4.2 JP5.2 JP6.2 JP7.2 JP8.2 JP9.2 JP10.2 JP11.2 JP12.2 JP13.2 JP14.2
  Bottom 1.27: JP3.2 19.68,4.45 | 19.68,4.45 JP14.2 | 19.68,4.45 19.68,12.06 13.99,17.76 SRVPWR.2
TXD
  Top 0.305: X1.8 15.99,53.07 14.73,51.82 14.73,50.29 13.34,48.9 12.06,48.9 10.79,47.62 JP18.3

### Text on the board
tPlace: SDA | SCL | TX | RX | 04 | 17 | 18 | 27 | 22 | 23 | 24 | 25 | MOSI | MISO | CLK | CE0 | CE1 | 05 | 06 | 12 | 13 | 16 | 19 | 26 | + | - | RPiPWM / v1.2 | + | - | + | SDA | SCL | 3.3V | GND | - | GND | 0 | 1 | 2 | 3 | 4 | 5 | 6 | 7 | 8 | 9 | 10 | 11 | 12 | 13 | 14 | 15 | S | + | - | NO PWR